# EAGLE design main (EAGLE 9.6.2)
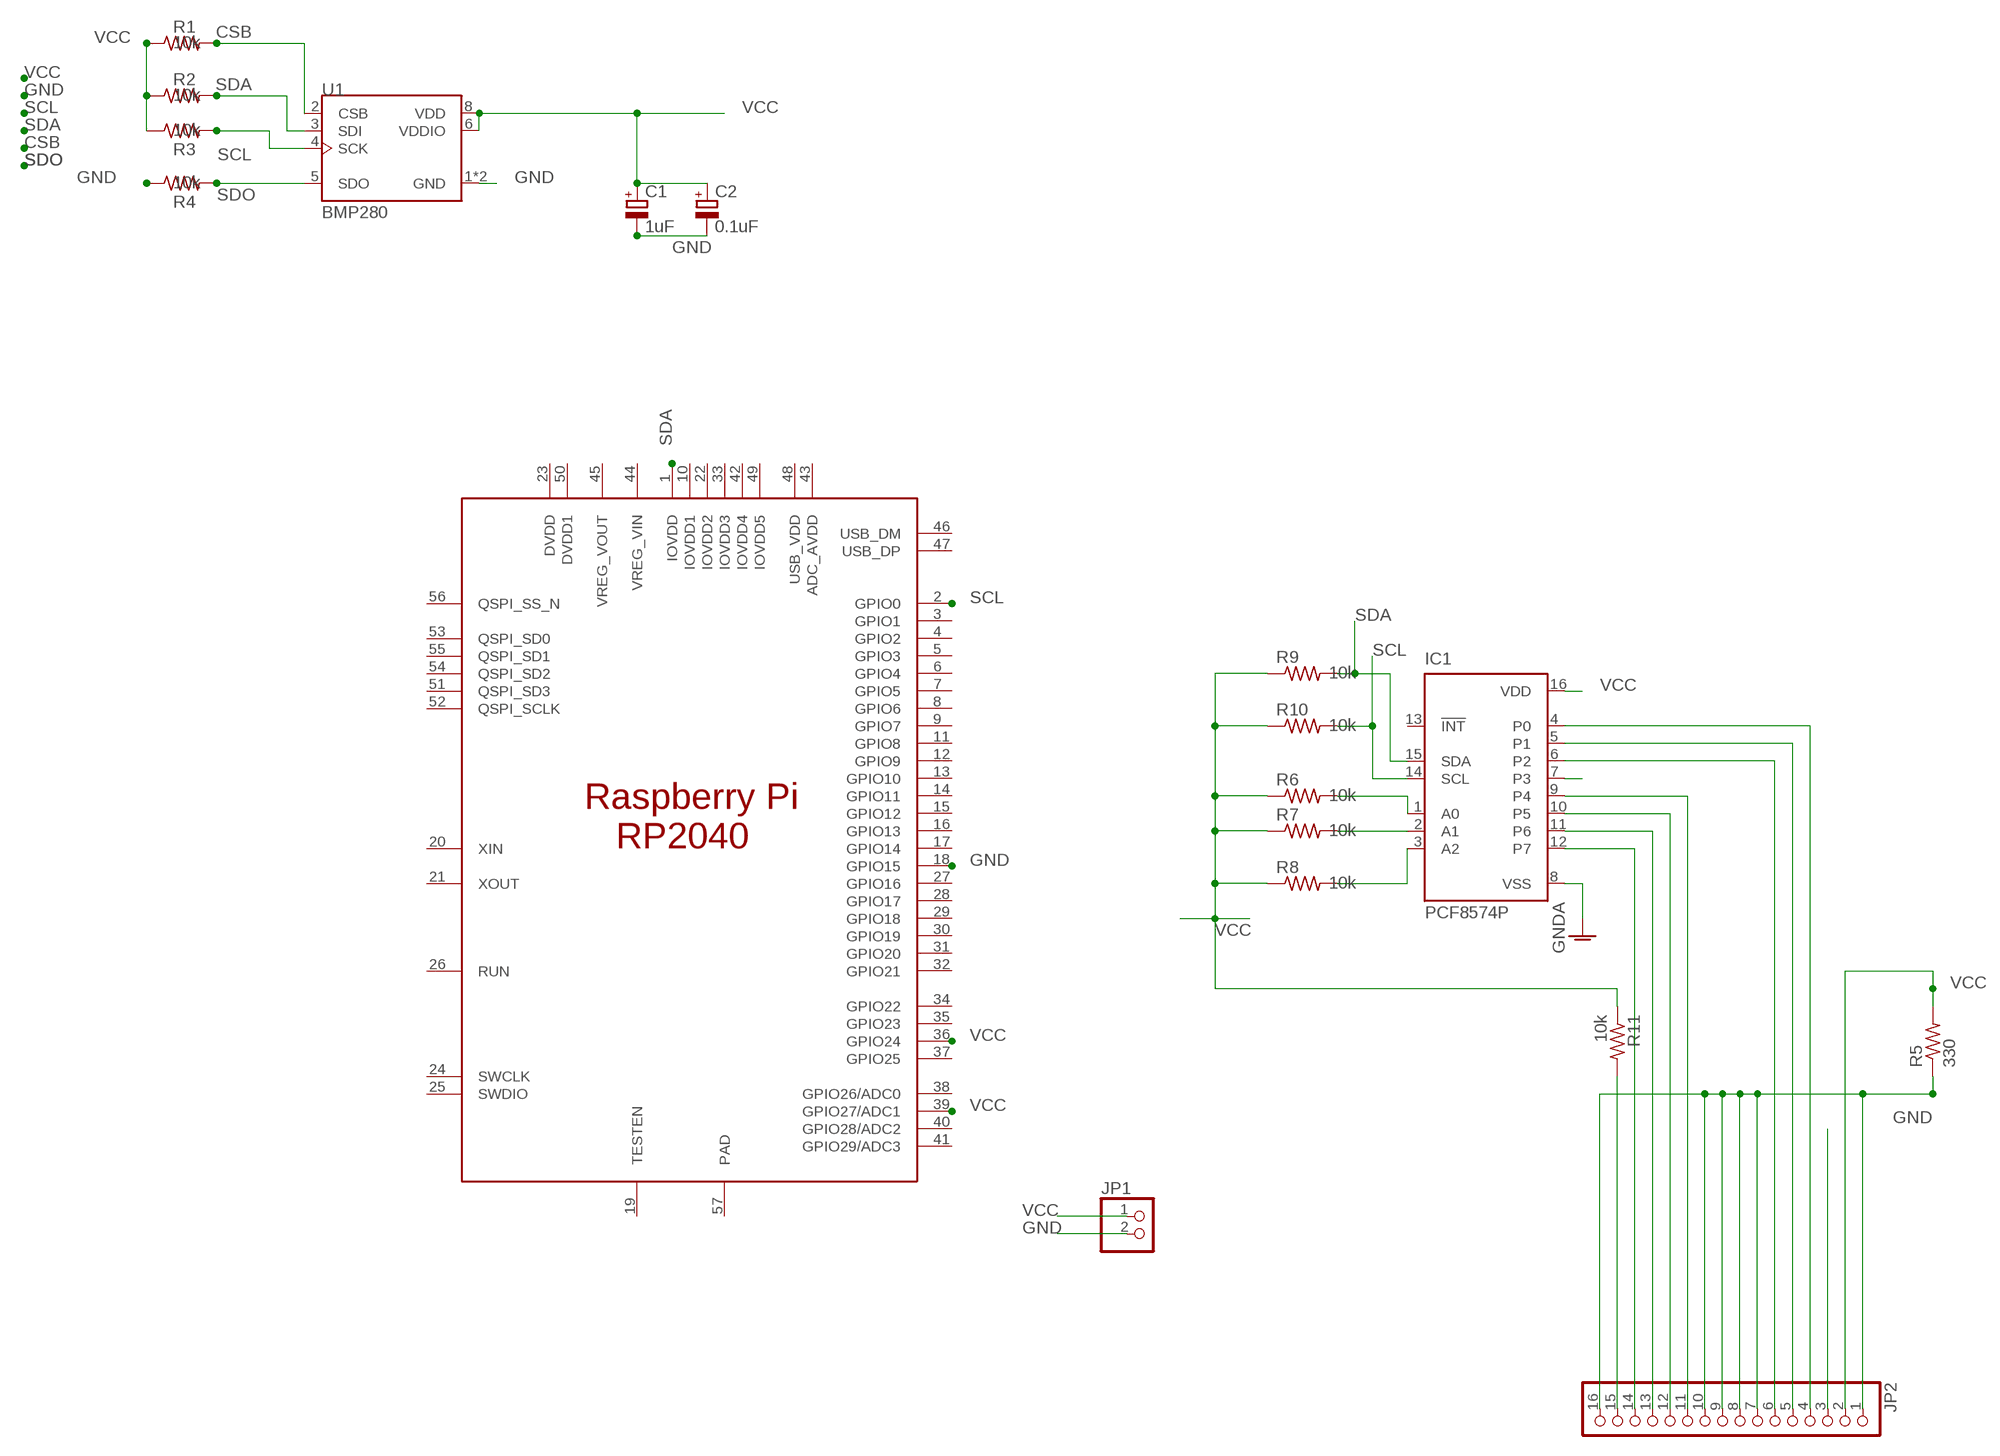
[diagram p0: schematic, sheet 1]

## Parts
C1  1uF  CPOL-EUE2-5  [E2-5]
C2  0.1uF  CPOL-EUE2-5  [E2-5]
IC1  PCF8574P  [DIL16]
JP1  PINHD-1X2  [1X02]
JP2  PINHD-1X16  [1X16]
R1  10k  R-US_0204/7  [0204/7]
R2  10k  R-US_0204/7  [0204/7]
R3  10k  R-US_0204/7  [0204/7]
R4  10k  R-US_0204/7  [0204/7]
R5  330  R-US_0204/7  [0204/7]
R6  10k  R-US_0204/7  [0204/7]
R7  10k  R-US_0204/7  [0204/7]
R8  10k  R-US_0204/7  [0204/7]
R9  10k  R-US_0204/7  [0204/7]
R10  10k  R-US_0204/7  [0204/7]
R11  10k  R-US_0204/7  [0204/7]
U1  BMP280  [XDCR_BMP280]
U$1  RP2040  [QFN40P695X695X90-57T320N]

## Nets
CSB: R1.2 U1.2(CSB)
GND: C1.- C2.- JP1.2 JP2.1 JP2.7 JP2.8 JP2.9 JP2.10 JP2.16 R4.1 R5.1 U1.1(GND) U1.7(GND) U$1.18(GPIO15)
GNDA: IC1.8(VSS)
N$1: IC1.12(P7) JP2.14
N$2: IC1.11(P6) JP2.13
N$3: IC1.10(P5) JP2.12
N$4: IC1.9(P4) JP2.11
N$5: IC1.4(P0) JP2.4
N$6: IC1.7(P3)
N$7: IC1.5(P1) JP2.5
N$8: IC1.6(P2) JP2.6
N$9: IC1.1(A0) R6.2
N$10: IC1.2(A1) R7.2
N$11: IC1.3(A2) R8.2
N$12: JP2.3
N$14: JP2.15 R11.2
SCL: IC1.14(SCL) R3.2 R10.2 U1.4(SCK) U$1.2(GPIO0)
SDA: IC1.15(SDA) R2.2 R9.2 U1.3(SDI) U$1.1(IOVDD)
SDO: R4.2 U1.5(SDO)
VCC: C1.+ C2.+ IC1.16(VDD) JP1.1 JP2.2 R1.1 R2.1 R3.1 R5.2 R6.1 R7.1 R8.1 R9.1 R10.1 R11.1 U1.6(VDDIO) U1.8(VDD) U$1.36(GPIO24) U$1.39(GPIO27/ADC1)
Unconnected: IC1.13(!INT) U$1.3(GPIO1) U$1.4(GPIO2) U$1.5(GPIO3) U$1.6(GPIO4) U$1.7(GPIO5) U$1.8(GPIO6) U$1.9(GPIO7) U$1.10(IOVDD1) U$1.11(GPIO8) U$1.12(GPIO9) U$1.13(GPIO10) U$1.14(GPIO11) U$1.15(GPIO12) U$1.16(GPIO13) U$1.17(GPIO14) U$1.19(TESTEN) U$1.20(XIN) U$1.21(XOUT) U$1.22(IOVDD2) U$1.23(DVDD) U$1.24(SWCLK) U$1.25(SWDIO) U$1.26(RUN) U$1.27(GPIO16) U$1.28(GPIO17) U$1.29(GPIO18) U$1.30(GPIO19) U$1.31(GPIO20) U$1.32(GPIO21) U$1.33(IOVDD3) U$1.34(GPIO22) U$1.35(GPIO23) U$1.37(GPIO25) U$1.38(GPIO26/ADC0) U$1.40(GPIO28/ADC2) U$1.41(GPIO29/ADC3) U$1.42(IOVDD4) U$1.43(ADC_AVDD) U$1.44(VREG_VIN) U$1.45(VREG_VOUT) U$1.46(USB_DM) U$1.47(USB_DP) U$1.48(USB_VDD) U$1.49(IOVDD5) U$1.50(DVDD1) U$1.51(QSPI_SD3) U$1.52(QSPI_SCLK) U$1.53(QSPI_SD0) U$1.54(QSPI_SD2) U$1.55(QSPI_SD1) U$1.56(QSPI_SS_N) U$1.57(PAD)

## Library data of the parts
C1 C2 = rcl:CPOL-EU: POLARIZED CAPACITOR, European symbol; SPICEPREFIX: C
IC1 = micro-philips:PCF8574: I2C-Bus Remote 8-bit I/O expander http://www.semiconductors.philips.com/acrobat_download/datasheets/PCF8574_4.pdf; MPN: PCF8574PN; OC_FARNELL: 204020; OC_NEWARK: 11N8515
JP1 = pinhead:PINHD-1X2: PIN HEADER
JP2 = pinhead:PINHD-1X16: PIN HEADER
R1-R11 = rcl:R-US_: RESISTOR, American symbol; SPICEPREFIX: R
U1 = BMP280:BMP280: BMP280 Absolute Barometric Pressure Sensor for Battery Powered Devices 2 x 2.5mm Check prices <https://pricing.snapeda.com/parts/BMP280/Bosch/view-part?ref=eda>; AVAILABILITY: In Stock; DESCRIPTION: Pressure Sensor 4.35PSI ~ 15.95PSI (30kPa ~ 110kPa) Absolute 16b 8-SMD; MF: Bosch; MP: BMP280; PACKAGE: SMD-8 Bosch Sensortec; PRICE: None; PURCHASE-URL: https://pricing.snapeda.com/search/part/BMP280/?ref=eda
U$1 = RP2040 (1):RP2040: Check prices <https://pricing.snapeda.com/parts/RP2040/Raspberry%20Pi/view-part?ref=eda>; AVAILABILITY: In Stock; DESCRIPTION: RP2040 Raspberry Pi Pico - ARM® Cortex®-M0+ MCU 32-Bit Embedded Evaluation Board; MF: Raspberry Pi; MP: RP2040; PACKAGE: Package; PRICE: None; PURCHASE-URL: https://pricing.snapeda.com/search/part/RP2040/?ref=eda

## Board
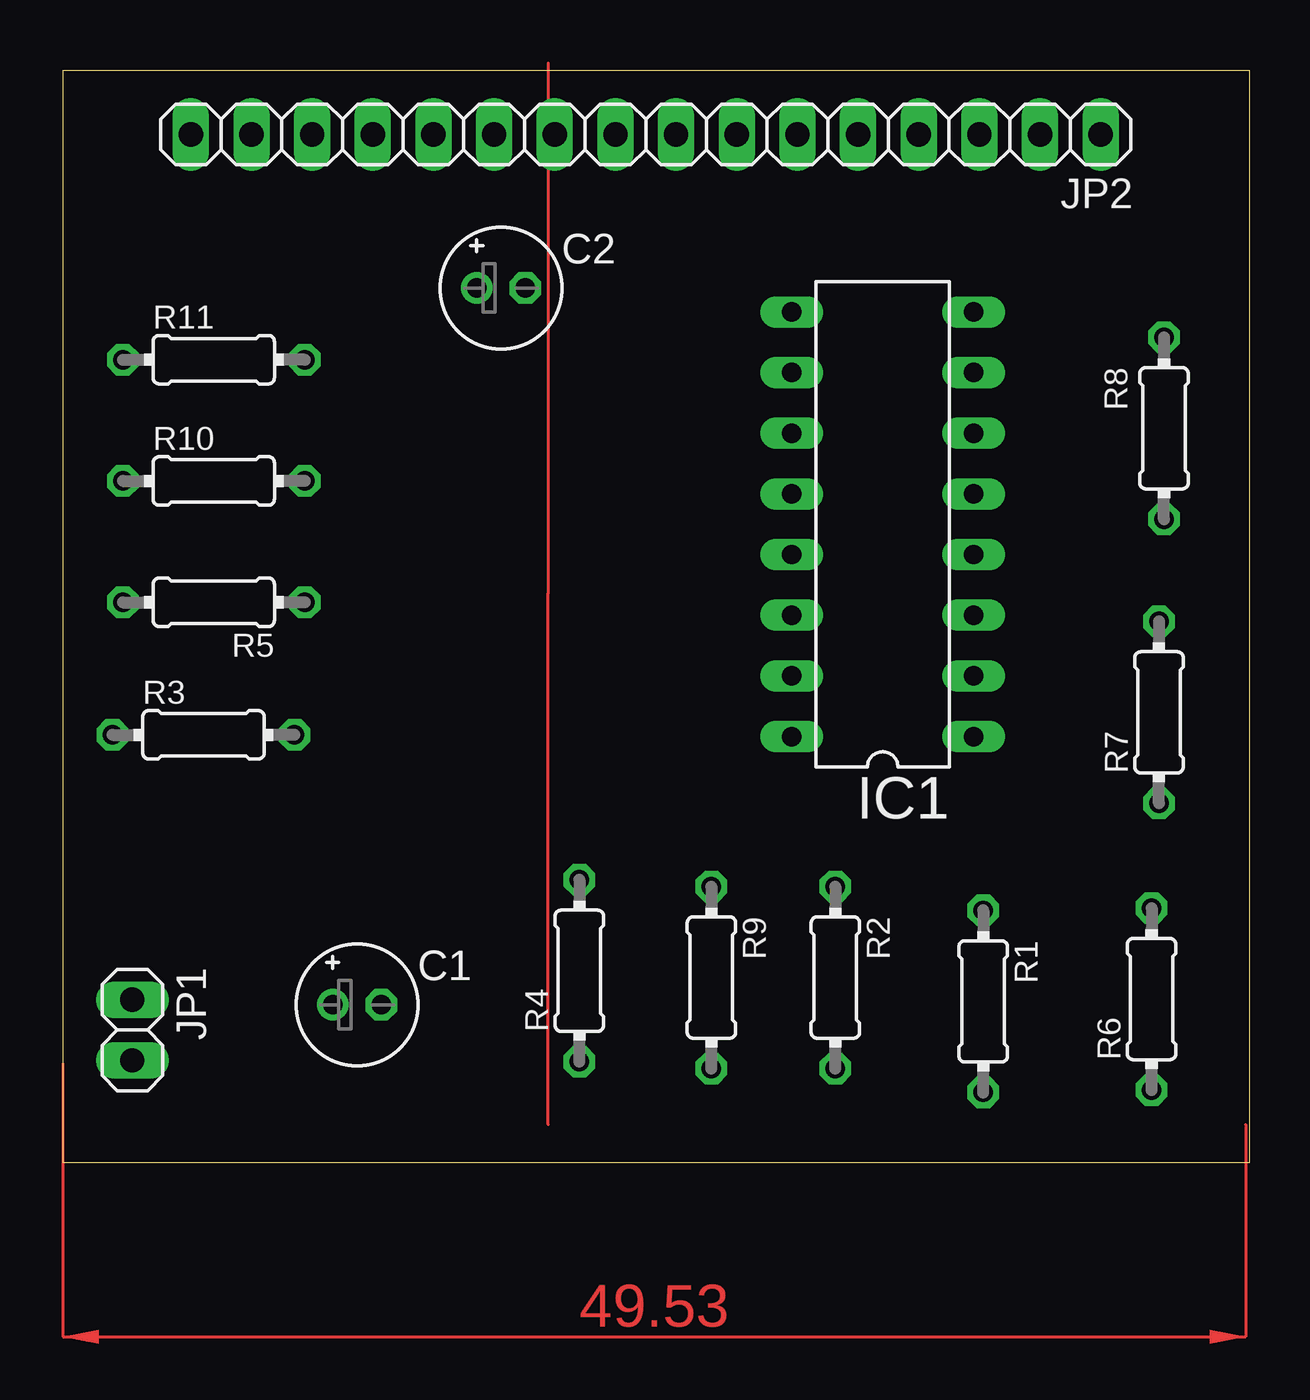
[diagram p1: board, top side]
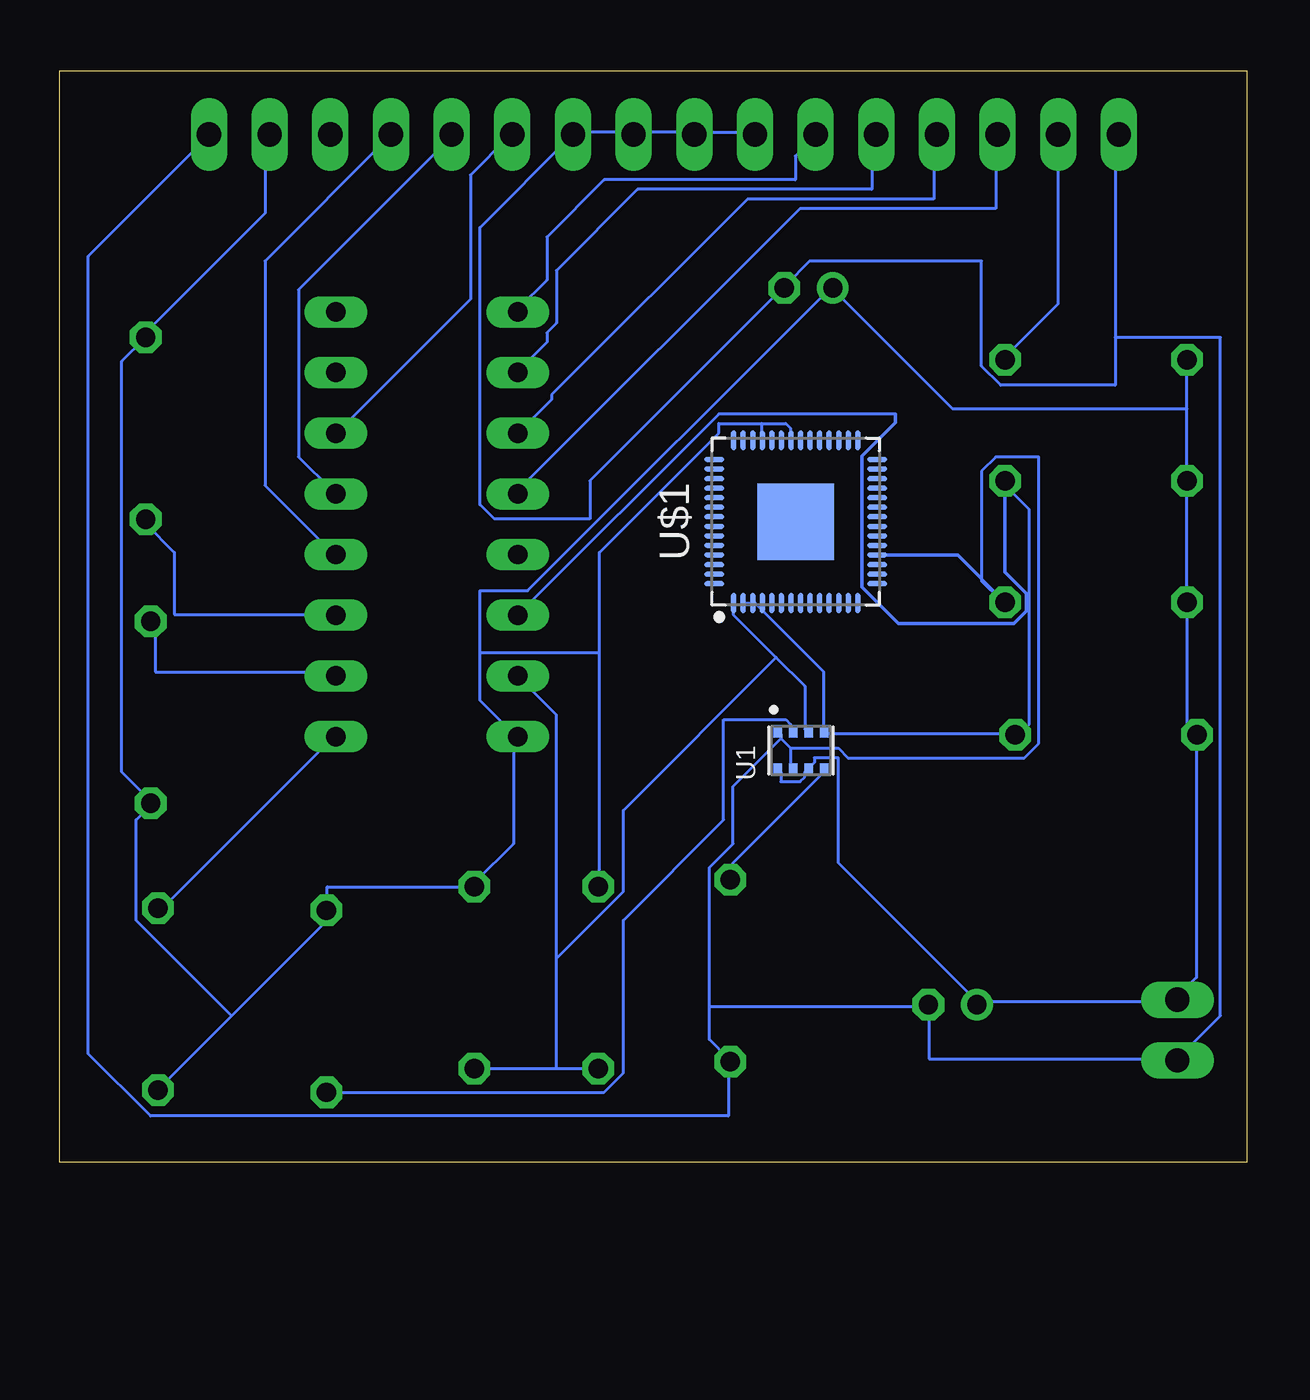
[diagram p2: board, bottom side, seen from below]

Size 49.71 x 45.7 mm. Coordinates in mm from the lower left corner, seen from the top.
Outline: 0,0 49.71,0 49.71,45.7 0,45.7 0,0
Copper layers (1*16): Top 0.035mm / dielectric 1.5mm / Bottom 0.035mm
Design rules "default *": minimum track width 0.12mm, minimum drill 0.2mm, track to track 6mil, track to pad 6mil, pad to pad 6mil, via to via 6mil, smd to smd 6mil, copper to edge 40mil, drill to drill 6mil, minimum pad ring 10mil, minimum via ring 8mil, stop-mask expansion 4mil, vias tented up to drill 0mil, thermal gap 10mil

### Footprints (pad centres in the part's own frame; a part is rotated, then mirrored left to right if it is on the bottom)
E2-5 = drill 0.813 pad 1.27: + -1.016,0 | drill 0.813 pad 1.27 octagon: - 1.016,0
DIL16 = drill 0.813 long: 1 -8.89,-3.81; 2 -6.35,-3.81; 3 -3.81,-3.81; 4 -1.27,-3.81; 5 1.27,-3.81; 6 3.81,-3.81; 7 6.35,-3.81; 8 8.89,-3.81; 9 8.89,3.81; 10 6.35,3.81; 11 3.81,3.81; 12 1.27,3.81; 13 -1.27,3.81; 14 -3.81,3.81; 15 -6.35,3.81; 16 -8.89,3.81
1X02 = drill 1.016 long: 1 -1.27,0; 2 1.27,0
1X16 = drill 1.016 long: 1 -19.05,0; 2 -16.51,0; 3 -13.97,0; 4 -11.43,0; 5 -8.89,0; 6 -6.35,0; 7 -3.81,0; 8 -1.27,0; 9 1.27,0; 10 3.81,0; 11 6.35,0; 12 8.89,0; 13 11.43,0; 14 13.97,0; 15 16.51,0; 16 19.05,0
0204/7 = drill 0.813 octagon: 1 -3.81,0; 2 3.81,0
XDCR_BMP280 = smd 0.5 x 0.35: 1 0.8,0.975; 2 0.8,0.325; 3 0.8,-0.325; 4 0.8,-0.975; 5 -0.8,-0.975; 6 -0.8,-0.325; 7 -0.8,0.325; 8 -0.8,0.975
QFN40P695X695X90-57T320N = smd 0.835 x 0.2: 1 -3.408,2.6; 2 -3.408,2.2; 3 -3.408,1.8; 4 -3.408,1.4; 5 -3.408,1; 6 -3.408,0.6; 7 -3.408,0.2; 8 -3.408,-0.2; 9 -3.408,-0.6; 10 -3.408,-1; 11 -3.408,-1.4; 12 -3.408,-1.8; 13 -3.408,-2.2; 14 -3.408,-2.6; 29 3.408,-2.6; 30 3.408,-2.2; 31 3.408,-1.8; 32 3.408,-1.4; 33 3.408,-1; 34 3.408,-0.6; 35 3.408,-0.2; 36 3.408,0.2; 37 3.408,0.6; 38 3.408,1; 39 3.408,1.4; 40 3.408,1.8; 41 3.408,2.2; 42 3.408,2.6 | smd 0.2 x 0.835: 15 -2.6,-3.408; 16 -2.2,-3.408; 17 -1.8,-3.408; 18 -1.4,-3.408; 19 -1,-3.408; 20 -0.6,-3.408; 21 -0.2,-3.408; 22 0.2,-3.408; 23 0.6,-3.408; 24 1,-3.408; 25 1.4,-3.408; 26 1.8,-3.408; 27 2.2,-3.408; 28 2.6,-3.408; 43 2.6,3.408; 44 2.2,3.408; 45 1.8,3.408; 46 1.4,3.408; 47 1,3.408; 48 0.6,3.408; 49 0.2,3.408; 50 -0.2,3.408; 51 -0.6,3.408; 52 -1,3.408; 53 -1.4,3.408; 54 -1.8,3.408; 55 -2.2,3.408; 56 -2.6,3.408 | smd 3.2 x 3.2: 57 0,0

### Placement (x,y rotation side)
C1  12.32,6.59 0 top
C2  18.35,36.6 0 top
IC1  34.33,26.71 90 top
JP1  2.91,5.53 270 top
JP2  24.41,43.03 180 top
R1  38.54,6.73 270 top
R2  32.35,7.73 270 top
R3  5.89,17.89 0 top
R4  21.63,8.01 90 top
R5  6.32,23.44 180 top
R6  45.59,6.83 90 top
R7  45.9,18.83 90 top
R8  46.11,30.73 270 top
R9  27.16,7.73 270 top
R10  6.32,28.52 0 top
R11  6.32,33.6 0 top
U1  18.67,17.24 90 bottom
U$1  18.89,26.82 90 bottom

### Tracks (layer width: path | path; a pad name or v marks a point on that pad's centre or on a via)
CSB
  Bottom 0.12: U1.2 19.11,18.13 19.11,18.33 19.31,18.53 21.91,18.53 21.91,14.33 26.11,10.13 26.11,3.73 26.91,2.93 38.51,2.93 R1.2
GND
  Bottom 0.12: JP2.10 20.71,43.13 23.11,43.13 JP2.9 23.31,43.13 25.51,43.13 JP2.8 25.71,43.13 28.11,43.13 JP2.7 28.31,42.93 32.11,39.13 32.11,27.53 31.51,26.93 27.51,26.93 27.51,28.53 19.51,36.53 C2.- 19.31,36.73 18.31,37.73 11.11,37.73 11.11,33.33 10.31,32.53 5.51,32.53 5.51,34.53 | 5.51,34.53 5.51,42.93 JP2.16 | 19.11,17.33 19.11,16.53 U1.7 | 19.51,17.73 19.11,17.33 | 19.51,17.73 19.51,17.93 U1.1 | 19.51,17.73 21.51,15.73 21.51,13.33 22.51,12.33 22.51,6.53 | 22.51,6.53 22.51,5.13 21.71,4.33 R4.1 21.71,4.13 21.71,1.93 45.91,1.93 48.51,4.53 48.51,37.93 43.51,42.93 JP2.1 | 22.51,6.53 13.51,6.53 C1.- 13.31,6.53 13.31,4.33 2.91,4.33 | 19.11,17.33 17.11,17.33 16.71,16.93 9.31,16.93 8.71,17.53 8.71,29.53 10.51,29.53 11.11,28.93 11.11,24.33 10.31,23.53 R5.1 | 5.51,34.53 1.11,34.53 1.11,6.13 2.91,4.33 | 2.91,4.33 JP1.2
  Bottom 0.152: R5.1 12.11,25.42 U$1.18
N$1
  Bottom 0.12: IC1.12 30.51,28.13 18.71,39.93 10.51,39.93 10.51,42.93 JP2.14
N$2
  Bottom 0.12: IC1.11 29.11,31.93 29.11,32.13 20.91,40.33 13.11,40.33 13.11,42.93 JP2.13
N$3
  Bottom 0.12: IC1.10 30.51,33.13 29.31,34.33 29.31,34.73 28.91,35.13 28.91,37.33 25.51,40.73 15.71,40.73 15.71,42.93 JP2.12
N$4
  Bottom 0.12: IC1.9 30.51,35.73 29.31,36.93 29.31,38.73 26.91,41.13 18.91,41.13 18.91,42.13 18.11,42.93 JP2.11
N$5
  Bottom 0.12: IC1.4 38.31,25.53 41.11,28.33 41.11,37.73 35.91,42.93 JP2.4
N$7
  Bottom 0.12: IC1.5 38.31,28.13 39.71,29.53 39.71,36.53 33.31,42.93 JP2.5
N$8
  Bottom 0.12: IC1.6 38.11,30.53 32.51,36.13 32.51,41.33 30.91,42.93 JP2.6
N$9
  Bottom 0.12: IC1.1 38.31,17.73 45.51,10.53 R6.2
N$10
  Bottom 0.12: IC1.2 38.31,20.53 45.71,20.53 45.71,22.53 R7.2
N$11
  Bottom 0.12: IC1.3 38.31,22.93 44.91,22.93 44.91,25.53 46.11,26.73 R8.2
N$14
  Bottom 0.12: R11.2 10.11,33.73 7.91,35.93 7.91,42.93 JP2.15
SCL
  Bottom 0.12: U$1.2 20.59,23.41 17.71,20.53 17.71,18.13 U1.4 17.71,17.93 9.71,17.93 R3.2 9.51,17.93 9.11,18.33 9.11,27.33 10.11,28.33 R10.2 | 14.71,31.33 22.11,31.33 30.51,22.93 IC1.14
  Bottom 0.152: R10.2 10.13,24.7 9.24,23.81 9.24,23.07 9.76,22.55 14.6,22.55 16.13,24.08 16.13,29.56 14.71,30.98 14.71,31.33
SDA
  Bottom 0.12: 19.71,21.13 21.51,22.93 21.51,23.33 U$1.1 | 19.71,21.13 18.51,19.93 18.51,18.13 U1.3 | 28.91,3.93 32.31,3.93 R2.2 | 28.91,3.93 27.31,3.93 R9.2 | 28.91,3.93 28.91,8.53 | 28.91,8.53 28.91,18.73 30.51,20.33 IC1.15 | 19.71,21.13 26.11,14.73 26.11,11.33 28.91,8.53
SDO
  Bottom 0.12: U1.5 17.71,16.33 21.51,12.53 21.51,11.93 R4.2
VCC
  Bottom 0.12: U1.8 19.51,16.33 19.51,15.93 18.71,15.93 18.51,16.13 18.51,16.33 U1.6 18.31,16.53 18.11,16.73 18.11,16.93 17.11,16.93 17.11,12.53 11.31,6.73 C1.+ 11.11,6.73 2.91,6.73 JP1.1 2.91,6.93 2.11,7.73 2.11,17.73 R3.1 2.11,17.93 2.51,18.33 R5.2 R10.1 2.51,31.53 | 2.51,31.53 R11.1 | 2.51,31.53 12.31,31.53 17.31,36.53 C2.+ 17.51,36.53 30.11,23.93 32.11,23.93 32.11,21.33 | 20.31,30.93 19.31,30.93 19.11,30.73 19.11,30.33 U$1.36 | 20.31,30.93 20.31,30.33 U$1.39 | 20.31,30.93 22.11,30.93 22.11,30.53 27.11,25.53 27.11,21.33 | 27.11,21.33 27.11,11.73 R9.1 | JP2.2 41.11,42.93 41.11,39.73 46.11,34.73 R8.1 47.11,33.53 47.11,16.33 45.91,15.13 R7.1 45.91,14.93 46.51,14.33 46.51,10.13 42.51,6.13 | 42.51,6.13 38.71,9.93 38.71,10.53 R1.1 38.51,10.73 38.51,11.53 32.51,11.53 R2.1 32.31,11.73 30.71,13.33 30.71,17.73 IC1.16 30.71,17.93 32.11,19.33 32.11,21.33 | 42.51,6.13 45.51,3.13 R6.1 | 32.11,21.33 27.11,21.33
(copper drawn outside any net)
  shapes: Top area x2